# EAGLE design rekick002 (EAGLE 4.16)

## Sheet 1 of 2
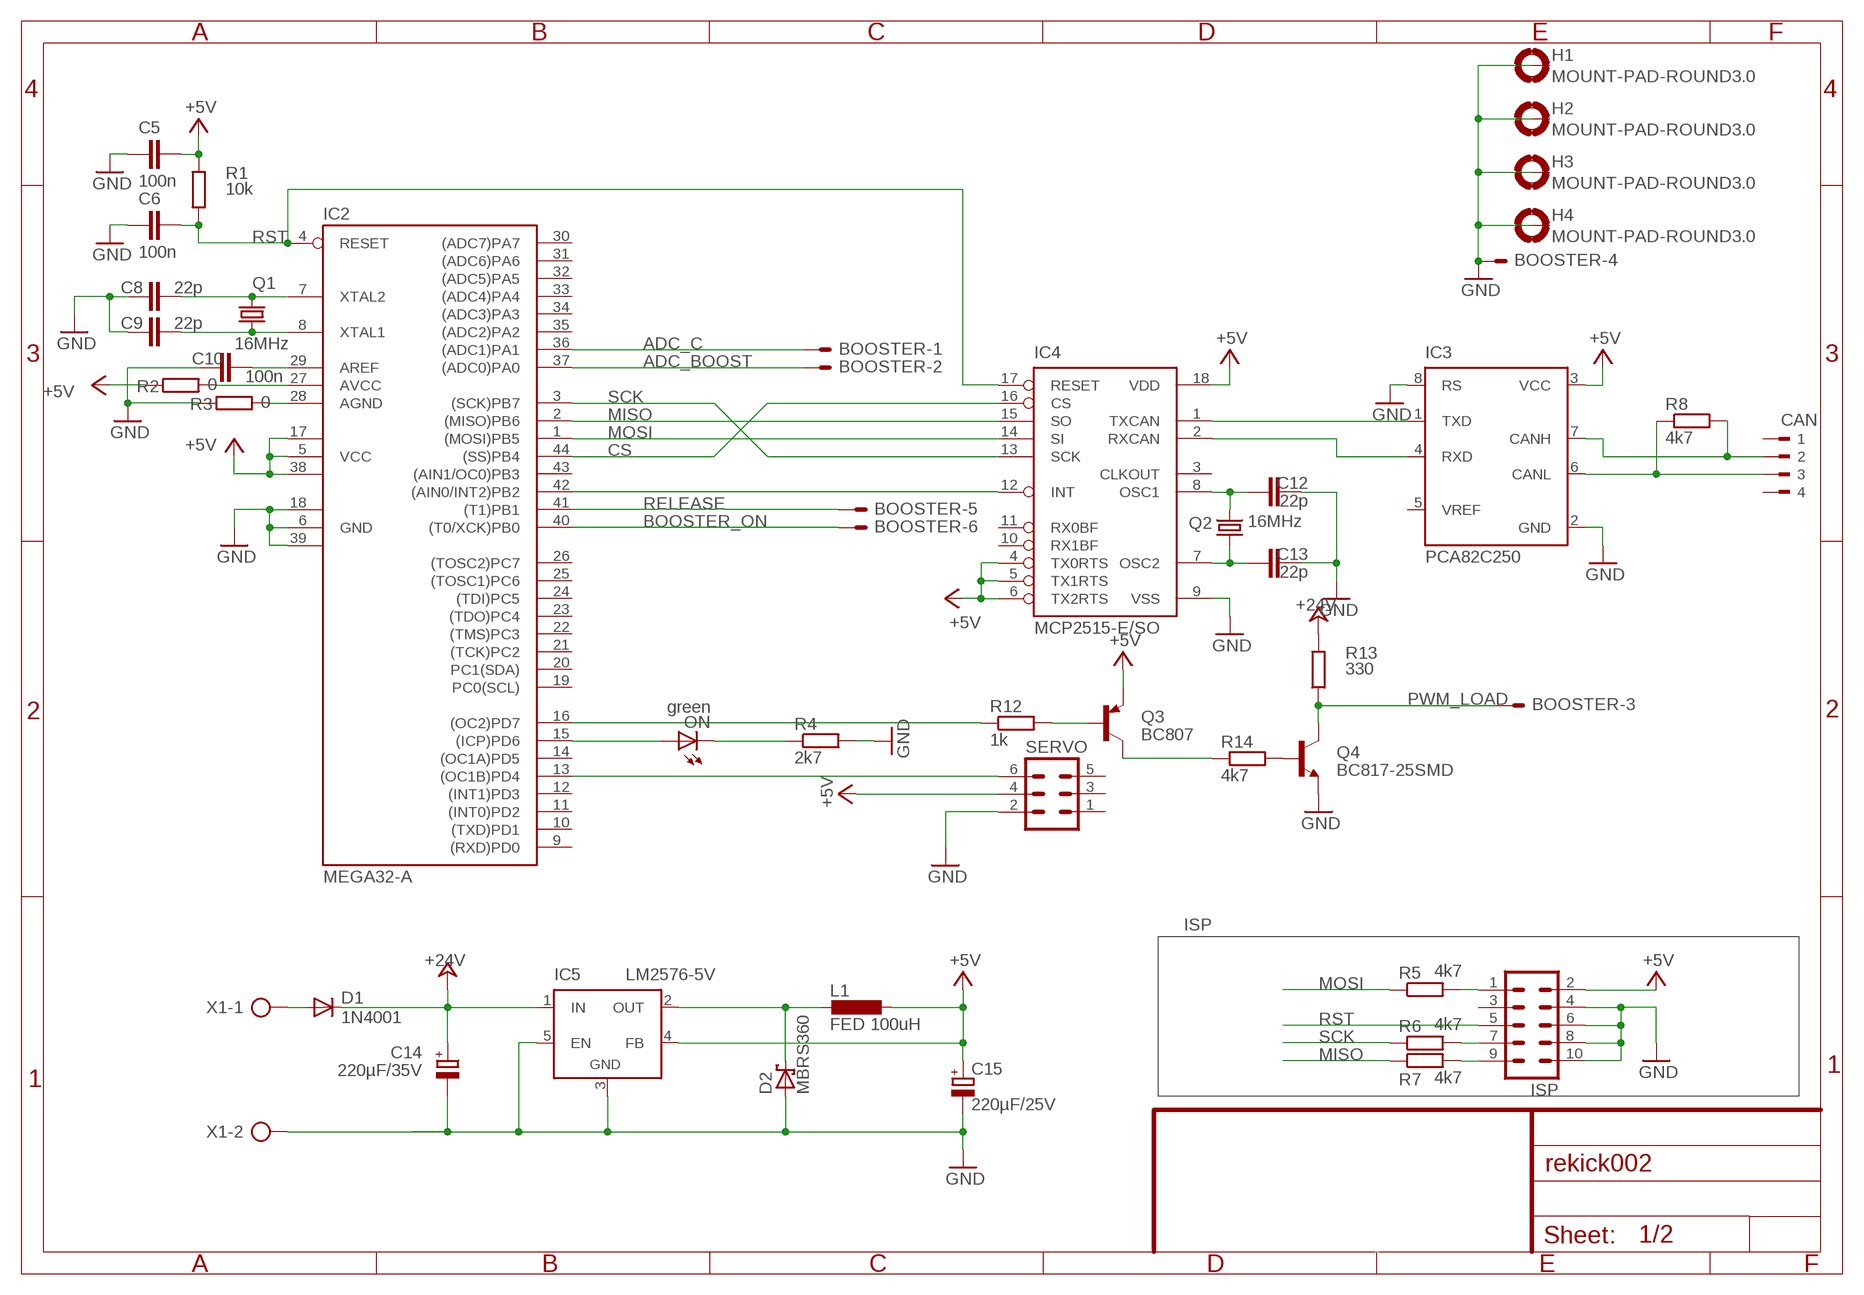
[diagram p0: schematic, sheet 1]

### Parts
BOOSTER  ML6LE  [ML6L]
C5  100n  C-EUC0603  [C0603]
C6  100n  C-EUC0603  [C0603]
C8  22p  C-EUC0603  [C0603]
C9  22p  C-EUC0603  [C0603]
C10  100n  C-EUC0603  [C0603]
C12  22p  C-EUC0603  [C0603]
C13  22p  C-EUC0603  [C0603]
C14  220µF/35V  CPOL-EUE5-10.5  [E5-10,5]
C15  220µF/25V  CPOL-EUE3.5-10  [E3,5-10]
CAN  90-4  [90-4]
D1  1N4001  1N4004  [DO41-10]
D2  MBRS360  SCHOTTKY-DIODESMD  [SMB]
H1  MOUNT-PAD-ROUND3.0  [3,0-PAD]
H2  MOUNT-PAD-ROUND3.0  [3,0-PAD]
H3  MOUNT-PAD-ROUND3.0  [3,0-PAD]
H4  MOUNT-PAD-ROUND3.0  [3,0-PAD]
IC2  MEGA32-A  [TQFP44]
IC3  PCA82C250  [DIL08]
IC4  MCP2515-E/SO  [SO18L]
IC5  LM2576-5V  LM2596TV  [TO220-51]
ISP  MA05-2  [MA05-2]
L1  FED 100uH  L-EUTJ4-U1  [TJ4-U1]
ON  green  LED3MM  [LED3MM]
Q1  16MHz  CRYSTALHC49S  [HC49/S]
Q2  16MHz  CRYSTALHC49U-V  [HC49U-V]
Q3  BC807  BC807-40SMD  [SOT23-BEC]
Q4  BC817-25SMD  [SOT23-BEC]
R1  10k  R-EU_R0805  [R0805]
R2  0  R-EU_R0805  [R0805]
R3  0  R-EU_R0805  [R0805]
R4  2k7  R-EU_R0805  [R0805]
R5  4k7  R-EU_R0805  [R0805]
R6  4k7  R-EU_R0805  [R0805]
R7  4k7  R-EU_R0805  [R0805]
R8  4k7  R-EU_R0805  [R0805]
R12  1k  R-EU_R0805  [R0805]
R13  330  R-EU_R0805  [R0805]
R14  4k7  R-EU_R0805  [R0805]
SERVO  ML6L  [ML6L]
X1  AK500/2-H  [AK500/2-H]

### Nets
+5V [Power]: C5.2 C15.+ IC2.5(VCC) IC2.17(VCC1) IC2.38(VCC2) IC3.3(VCC) IC4.4(TX0RTS) IC4.5(TX1RTS) IC4.6(TX2RTS) IC4.18(VDD) IC5.4(FB) ISP.2 L1.1 Q3.E R1.2 R2.1 SERVO.4
+24V [Power]: C14.+ D1.C IC5.1(IN) R13.2
ADC_BOOST: BOOSTER.2 IC2.37((ADC0)PA0)
ADC_C: BOOSTER.1 IC2.36((ADC1)PA1)
BOOSTER_ON: BOOSTER.6 IC2.40((T0/XCK)PB0)
CS: IC2.44((SS)PB4) IC4.16(CS)
GND [Power]: BOOSTER.4 C5.1 C6.1 C8.1 C9.2 C10.1 C12.2 C13.2 C14.- C15.- D2.A H1.B3,0(MOUNT) H2.B3,0(MOUNT) H3.B3,0(MOUNT) H4.B3,0(MOUNT) IC2.6(GND) IC2.18(GND1) IC2.39(GND2) IC3.2(GND) IC3.8(RS) IC4.9(VSS) IC5.3(GND) IC5.5(EN) ISP.4 ISP.6 ISP.8 ISP.10 Q4.E R3.1 R4.2 SERVO.2 X1.2
MISO: IC2.2((MISO)PB6) IC4.15(SO) R7.1
MOSI: IC2.1((MOSI)PB5) IC4.14(SI) R5.1
N$1: IC2.15((ICP)PD6) ON.A
N$2: C10.2 IC2.29(AREF)
N$3: IC2.27(AVCC) R2.2
N$4: C9.1 IC2.8(XTAL1) Q1.1
N$5: C8.2 IC2.7(XTAL2) Q1.2
N$6: ISP.1 R5.2
N$7: IC2.28(AGND) R3.2
N$8: ISP.7 R6.2
N$9: ISP.9 R7.2
N$11: IC2.42((AIN0/INT2)PB2) IC4.12(INT)
N$12: IC3.1(TXD) IC4.1(TXCAN)
N$13: IC2.16((OC2)PD7) R12.1
N$14: IC2.13((OC1B)PD4) SERVO.6
N$21: Q3.C R14.1
N$22: IC3.4(RXD) IC4.2(RXCAN)
N$23: Q4.B R14.2
N$24: CAN.3 IC3.6(CANL) R8.1
N$25: Q3.B R12.2
N$26: D1.A X1.1
N$30 [Power]: D2.C IC5.2(OUT) L1.2
N$31: ON.K(C) R4.1
N$53: C13.1 IC4.7(OSC2) Q2.1
N$54: C12.1 IC4.8(OSC1) Q2.2
N$59: CAN.2 IC3.7(CANH) R8.2
PWM_LOAD: BOOSTER.3 Q4.C R13.1
RELEASE: BOOSTER.5 IC2.41((T1)PB1)
RST: C6.2 IC2.4(RESET) IC4.17(RESET) ISP.5 R1.1
SCK: IC2.3((SCK)PB7) IC4.13(SCK) R6.1
Unconnected: CAN.1 CAN.4 IC2.9((RXD)PD0) IC2.10((TXD)PD1) IC2.11((INT0)PD2) IC2.12((INT1)PD3) IC2.14((OC1A)PD5) IC2.19(PC0(SCL)) IC2.20(PC1(SDA)) IC2.21((TCK)PC2) IC2.22((TMS)PC3) IC2.23((TDO)PC4) IC2.24((TDI)PC5) IC2.25((TOSC1)PC6) IC2.26((TOSC2)PC7) IC2.30((ADC7)PA7) IC2.31((ADC6)PA6) IC2.32((ADC5)PA5) IC2.33((ADC4)PA4) IC2.34((ADC3)PA3) IC2.35((ADC2)PA2) IC2.43((AIN1/OC0)PB3) IC3.5(VREF) IC4.3(CLKOUT) IC4.10(RX1BF) IC4.11(RX0BF) ISP.3 SERVO.1 SERVO.3 SERVO.5

### Notes on the sheet
- ISP

## Sheet 2 of 2
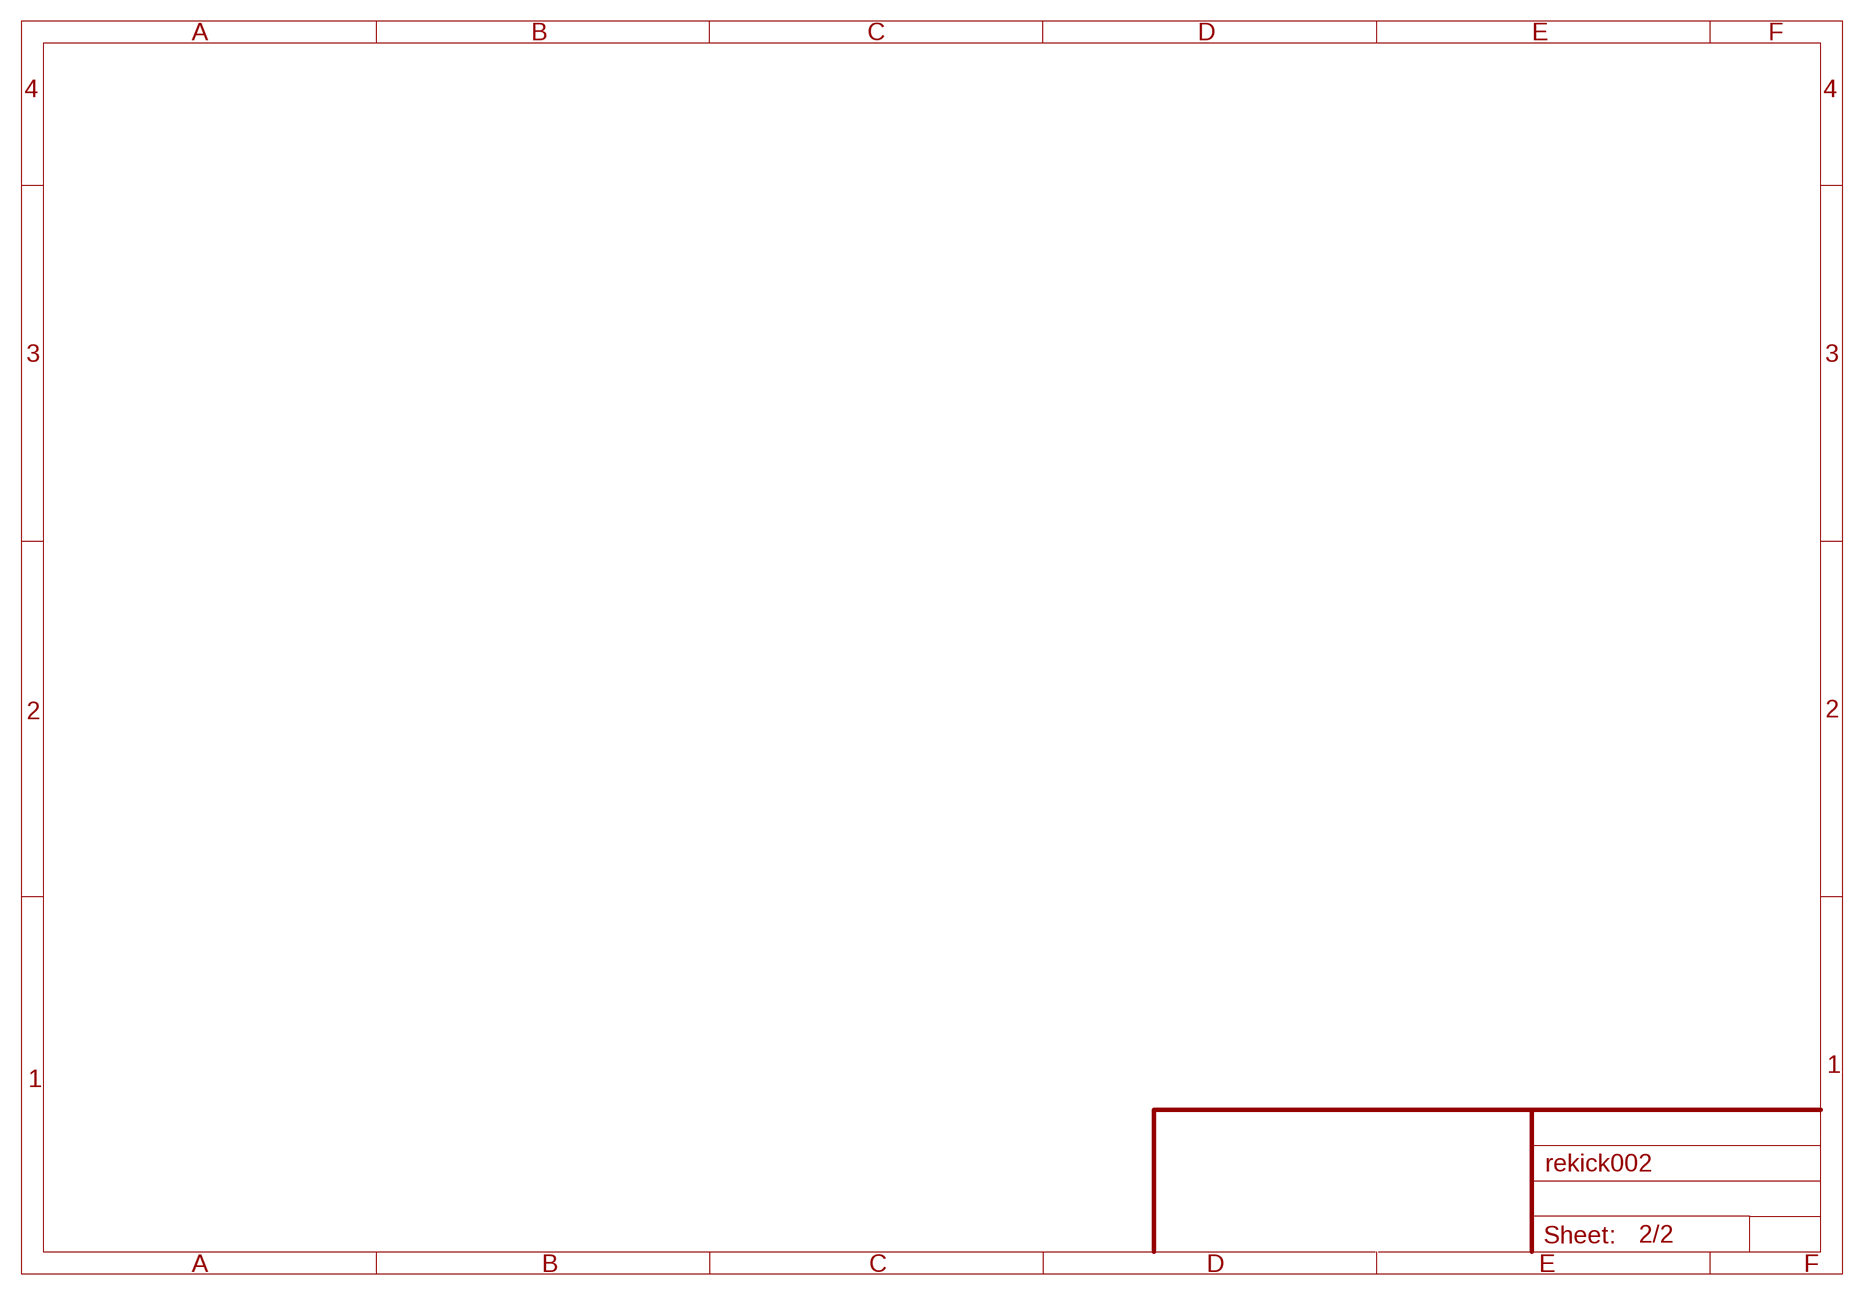
[diagram p1: schematic, sheet 2]

## Library data of the parts
BOOSTER = con-harting-ml:ML6?E: HARTING
C5 C6 C8-C10 C12 C13 = rcl:C-EU: CAPACITOR, European symbol
C14 C15 = rcl:CPOL-EU: POLARIZED CAPACITOR, European symbol
CAN = con-weidmueller-sl35:90-4: WEIDMUELLER CLAMP CONNECTOR
D1 = diode:1N4004: DIODE general purpose rectifier, 1 A
D2 = diode:SCHOTTKY-DIODE: Schottky Diode
H1-H4 = holes:MOUNT-PAD-ROUND: MOUNTING PAD, round
IC2 = atmel:MEGA32: MICROCONTROLLER 32 Kbytes FLASH 2 Kbytes SRAM 1 Kbytes EEPROM USART 8-channel 10 bit ADC Source: www.atmel.com .. doc2503.pdf
IC3 = micro-philips:PCA82C250: CAN CONTROLLER INTERFACE
IC4 = mcp2515:MCP2515
IC5 = linear:LM2596T: STEP-DOWN VOLTAGE REGULATOR
ISP = con-lstb:MA05-2: PIN HEADER
L1 = rcl:L-EU: INDUCTOR, European symbol
ON = led:LED: LED OSRAM: - CHIPLED LG R971, LG N971, LY N971, LG Q971, LY Q971, LO R971, LY R971 LH N974, LH R974 LS Q976, LO Q976, LY Q976 LO Q996 - Hyper CHIPLED LW Q18S LB Q993, LB Q99A, LB R99A - SideLED LS A670, LO A670, LY A670, LG A670, LP A670 LB A673, LV A673, LT A673, LW A673 LH A674 LY A675 LS A676, LA A676, LO A676, LY A676, LW A676 LS A679, LY A679, LG A679 - Hyper Micro SIDELED® LS Y876, LA Y876, LO Y876, LY Y876 LT Y87S - SmartLED LW L88C, LW L88S LB L89C, LB L89S, LG L890 LS L89K, LO L89K, LY L89K LS L896, LA L896, LO L896, LY L896 - TOPLED LS T670, LO T670, LY T670, LG T670, LP T670 LSG T670, LSP T670, LSY T670, LOP T670, LYG T670 LG T671, LOG T671, LSG T671 LB T673, LV T673, LT T673, LW T673 LH T674 LS T676, LA T676, LO T676, LY T676, LB T676, LH T676, LSB T676, LW T676 LB T67C, LV T67C, LT T67C, LS T67K, LO T67K, LY T67K, LW E67C LS E67B, LA E67B, LO E67B, LY E67B, LB E67C, LV E67C, LT E67C LW T67C LS T679, LY T679, LG T679 LS T770, LO T770, LY T770, LG T770, LP T770 LB T773, LV T773, LT T773, LW T773 LH T774 LS E675, LA E675, LY E675, LS T675 LS T776, LA T776, LO T776, LY T776, LB T776 LHGB T686 LT T68C, LB T68C - Hyper Mini TOPLED® LB M676 - Mini TOPLED Santana® LG M470 LS M47K, LO M47K, LY M47K Source: http://www.osram.convergy.de - LUMILED® LXK2-PW12-R00, LXK2-PW12-S00, LXK2-PW14-U00, LXK2-PW14-V00 LXK2-PM12-R00, LXK2-PM12-S00, LXK2-PM14-U00 LXK2-PE12-Q00, LXK2-PE12-R00, LXK2-PE12-S00, LXK2-PE14-T00, LXK2-PE14-U00 LXK2-PB12-K00, LXK2-PB12-L00, LXK2-PB12-M00, LXK2-PB14-N00, LXK2-PB14-P00, LXK2-PB14-Q00 LXK2-PR12-L00, LXK2-PR12-M00, LXK2-PR14-Q00, LXK2-PR14-R00 LXK2-PD12-Q00, LXK2-PD12-R00, LXK2-PD12-S00 LXK2-PH12-R00, LXK2-PH12-S00 LXK2-PL12-P00, LXK2-PL12-Q00, LXK2-PL12-R00 Source: www.luxeon.com
Q1 Q2 = crystal:CRYSTAL: CRYSTAL
Q3 = transistor-pnp:BC807*: PNP Transistror
Q4 = transistor-npn:BC817*: NPN Transistor
R1-R8 R12-R14 = rcl:R-EU_: RESISTOR, European symbol
SERVO = con-harting-ml:ML6: HARTING
X1 = con-ptr500:AK500/2-H: CONNECTOR Aug. 2004 / PTR Meßtechnik: Die Bezeichnung der Serie AK505 wurde geändert. Es handelt sich hierbei um AK500 in horizontaler Ausführung.

## Net classes
1 Power: width 0.406 mm
2 High Power: width 2 mm

## Board
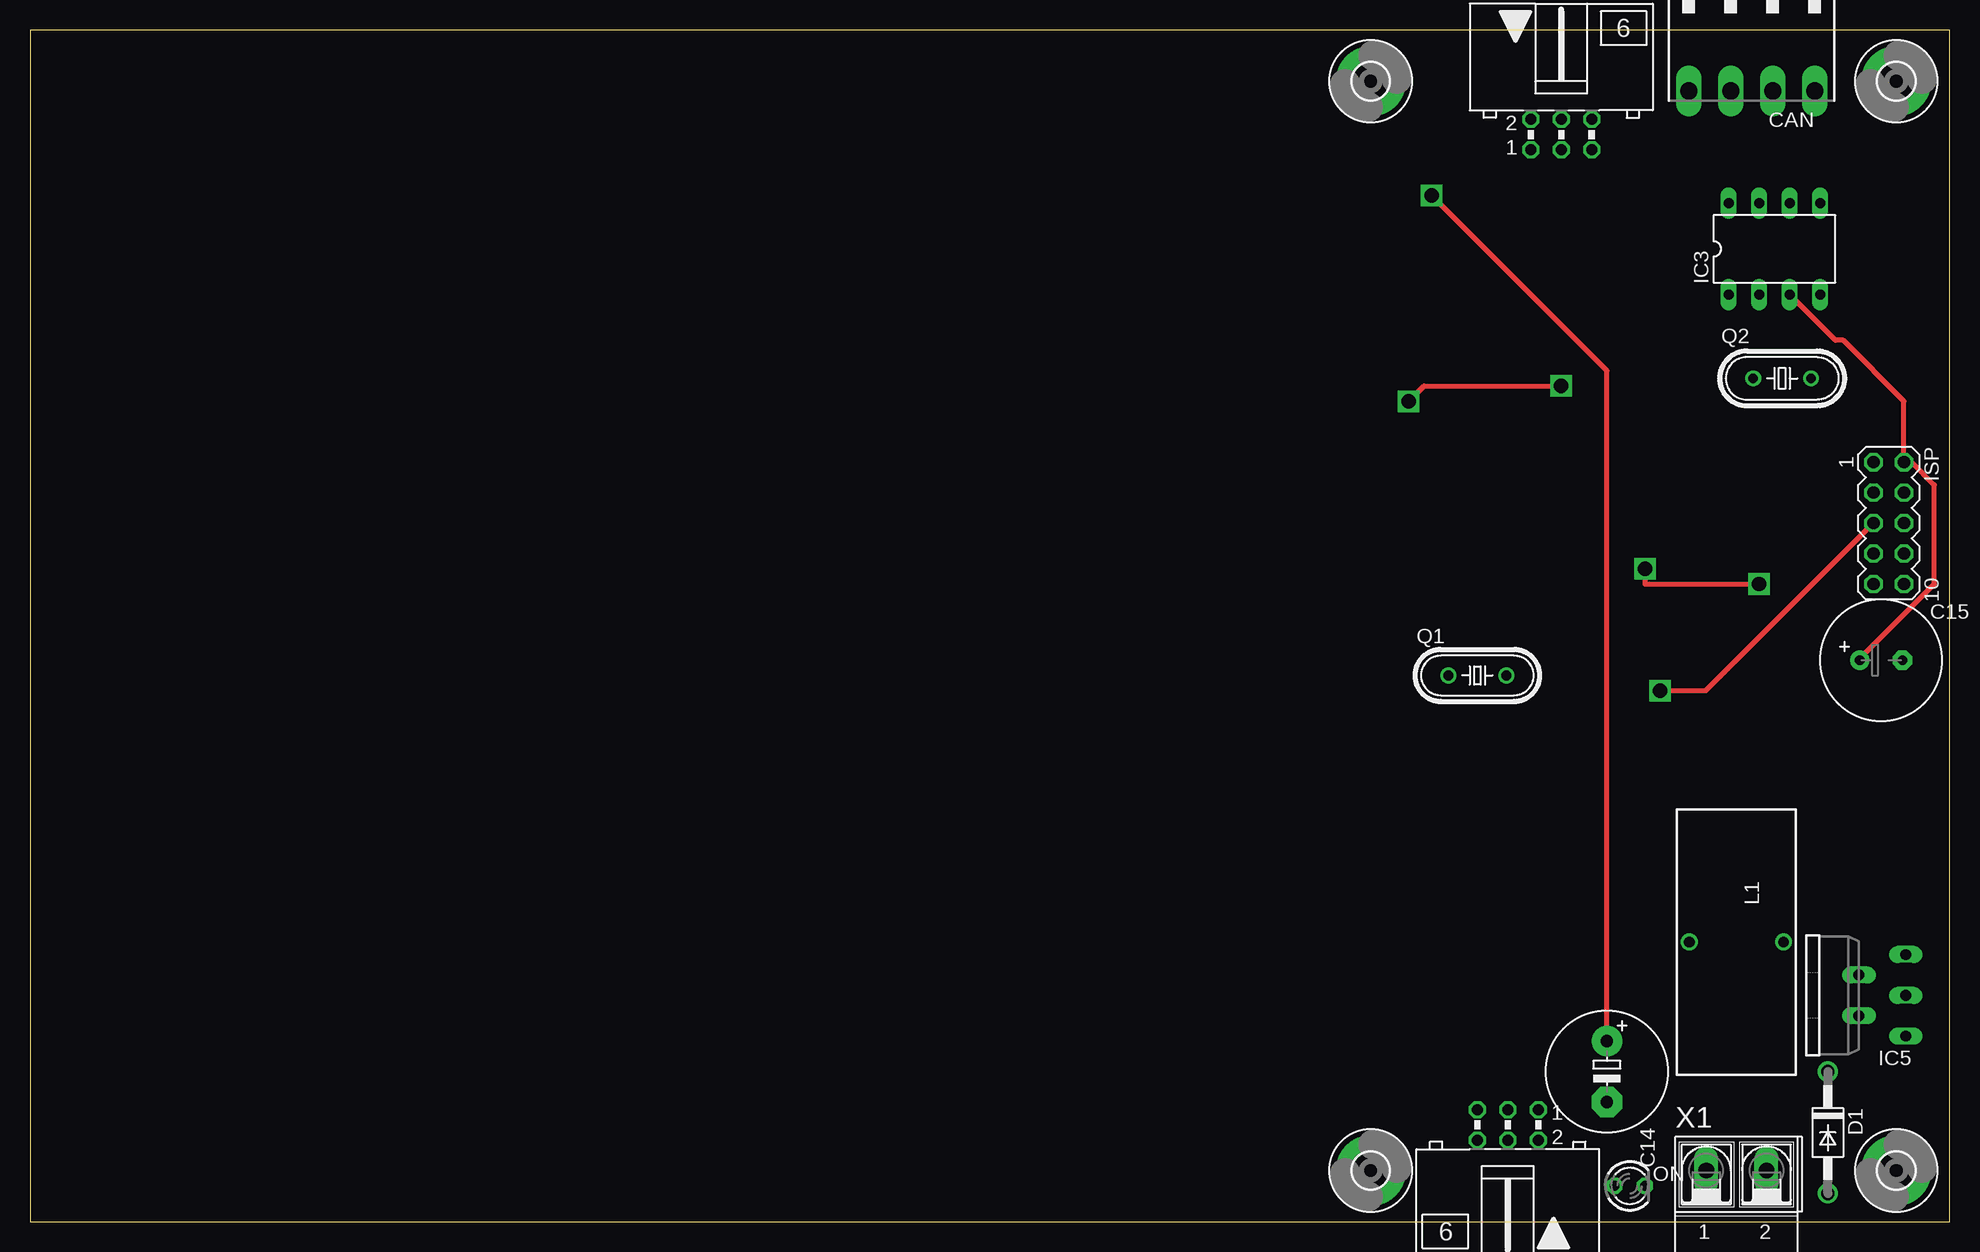
[diagram p2: board, top side]
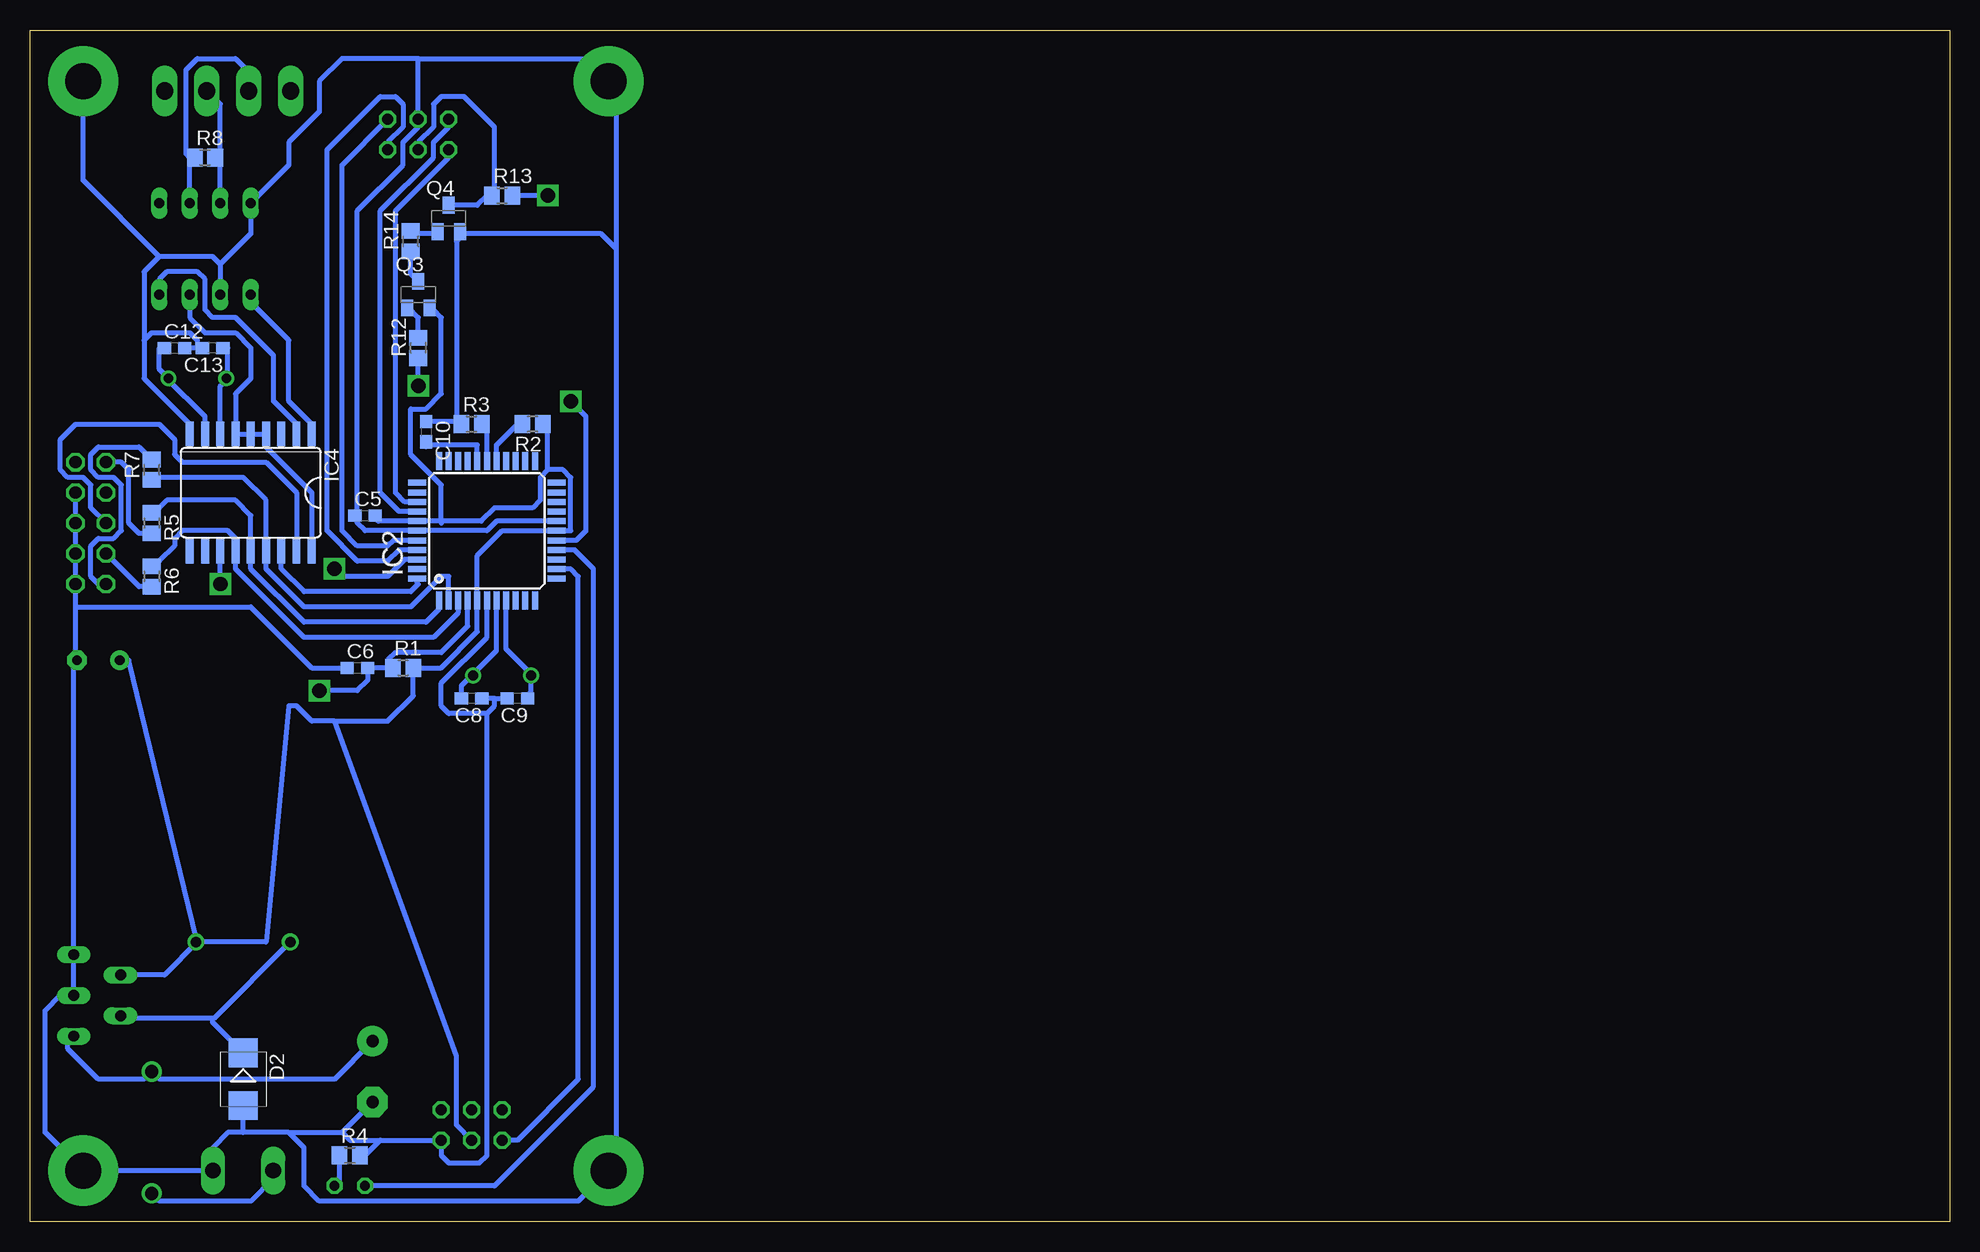
[diagram p3: board, bottom side, seen from below]

Size 160 x 99.36 mm. Coordinates in mm from the lower left corner, seen from the top.
Outline: 0,0 160,0 160,99.36 0,99.36 0,0
Copper layers (1*16): Top 0.035mm / dielectric 1.5mm / Bottom 0.035mm
Design rules "olimex_8mils": minimum track width 10mil, minimum drill 24mil, track to track 8mil, track to pad 8mil, pad to pad 8mil, via to via 8mil, smd to smd 8mil, copper to edge 40mil, drill to drill 10mil, minimum pad ring 10mil, minimum via ring 8mil, stop-mask expansion 0mil, vias tented up to drill 0mil, thermal gap 10mil

### Footprints (pad centres in the part's own frame; a part is rotated, then mirrored left to right if it is on the bottom)
ML6L = drill 0.914 octagon: 1 -2.54,-1.27; 2 -2.54,1.27; 3 0,-1.27; 4 0,1.27; 5 2.54,-1.27; 6 2.54,1.27
C0603 = smd 1.1 x 1: 1 -0.85,0; 2 0.85,0
E5-10,5 = drill 1.016 pad 2.54 round: + -2.54,0 | drill 1.016 pad 2.54 octagon: - 2.54,0
E3,5-10 = drill 0.813 pad 1.6 round: + -1.778,0 | drill 0.813 pad 1.6 octagon: - 1.778,0
90-4 = drill 1.422 long: 1 -5.25,5.25; 2 -1.75,5.25; 3 1.75,5.25; 4 5.25,5.25
DO41-10 = drill 1.118 round: A 5.08,0; C -5.08,0
SMB = smd 2.4 x 2.4: A 2.2,0; C -2.2,0
3,0-PAD = drill 3 pad 5.842 round: B3,0 0,0
TQFP44 = smd 1.5 x 0.5: 1 -5.8,4; 2 -5.8,3.2; 3 -5.8,2.4; 4 -5.8,1.6; 5 -5.8,0.8; 6 -5.8,0; 7 -5.8,-0.8; 8 -5.8,-1.6; 9 -5.8,-2.4; 10 -5.8,-3.2; 11 -5.8,-4; 23 5.8,-4; 24 5.8,-3.2; 25 5.8,-2.4; 26 5.8,-1.6; 27 5.8,-0.8; 28 5.8,0; 29 5.8,0.8; 30 5.8,1.6; 31 5.8,2.4; 32 5.8,3.2; 33 5.8,4 | smd 0.5 x 1.5: 12 -4,-5.8; 13 -3.2,-5.8; 14 -2.4,-5.8; 15 -1.6,-5.8; 16 -0.8,-5.8; 17 0,-5.8; 18 0.8,-5.8; 19 1.6,-5.8; 20 2.4,-5.8; 21 3.2,-5.8; 22 4,-5.8; 34 4,5.8; 35 3.2,5.8; 36 2.4,5.8; 37 1.6,5.8; 38 0.8,5.8; 39 0,5.8; 40 -0.8,5.8; 41 -1.6,5.8; 42 -2.4,5.8; 43 -3.2,5.8; 44 -4,5.8
DIL08 = drill 0.813 long: 1 -3.81,-3.81; 2 -1.27,-3.81; 3 1.27,-3.81; 4 3.81,-3.81; 5 3.81,3.81; 6 1.27,3.81; 7 -1.27,3.81; 8 -3.81,3.81
SO18L = smd 0.66 x 2.032: 1 -5.08,-4.902; 2 -3.81,-4.902; 3 -2.54,-4.902; 4 -1.27,-4.902; 5 0,-4.902; 6 1.27,-4.902; 7 2.54,-4.902; 8 3.81,-4.902; 9 5.08,-4.902; 10 5.08,4.902; 11 3.81,4.902; 12 2.54,4.902; 13 1.27,4.902; 14 0,4.902; 15 -1.27,4.902; 16 -2.54,4.902; 17 -3.81,4.902; 18 -5.08,4.902
TO220-51 = drill 0.9 long: 1 -3.4,-8.4; 2 -1.7,-4.5; 3 0,-8.4; 4 1.7,-4.5; 5 3.4,-8.4
MA05-2 = drill 1.016 octagon: 1 -5.08,-1.27; 2 -5.08,1.27; 3 -2.54,-1.27; 4 -2.54,1.27; 5 0,-1.27; 6 0,1.27; 7 2.54,-1.27; 8 2.54,1.27; 9 5.08,-1.27; 10 5.08,1.27
TJ4-U1 = drill 0.9 round: 1 -3.935,0; 2 3.935,0
LED3MM = drill 0.813 octagon: A -1.27,0; K 1.27,0
HC49/S = drill 0.813 round: 1 -2.413,0; 2 2.413,0
HC49U-V = drill 0.813 round: 1 -2.413,0; 2 2.413,0
SOT23-BEC = smd 1 x 1.4: B -0.95,-1.1; C 0,1.1; E 0.95,-1.1
R0805 = smd 1.3 x 1.5: 1 -0.85,0; 2 0.85,0
AK500/2-H = drill 1.321 long: 1 -2.515,0; 2 2.515,0

### Placement (x,y rotation side)
BOOSTER  127.63,90.64 0 top
C5  132.07,58.89 0 bottom
C6  132.71,46.19 0 bottom
C8  123.19,43.65 180 bottom
C9  119.38,43.65 180 bottom
C10  126.99,65.88 270 bottom
C12  147.95,72.86 0 bottom
C13  144.78,72.86 180 bottom
C14  131.44,12.54 270 top
C15  154.3,46.83 0 top
CAN  143.5,99.53 180 top
D1  149.85,7.46 270 top
D2  142.23,11.9 270 bottom
H1  111.75,95.08 0 top
H2  111.75,4.28 0 top
H3  155.57,95.08 0 top
H4  155.57,4.28 0 top
IC2  121.91,57.62 90 bottom
IC3  145.41,81.11 0 top
IC4  141.6,60.8 180 bottom
IC5  147.95,18.89 90 top
ISP  154.94,58.26 270 top
L1  142.23,23.33 180 top
ON  133.34,3.01 0 top
Q1  120.64,45.55 0 top
Q2  146.04,70.32 0 top
Q3  127.63,77.3 0 bottom
Q4  125.09,83.65 0 bottom
R1  128.9,46.19 0 bottom
R2  118.1,66.51 180 bottom
R3  123.19,66.51 0 bottom
R4  133.34,5.55 0 bottom
R5  149.85,58.26 270 bottom
R6  149.85,53.81 270 bottom
R7  149.85,62.7 90 bottom
R8  145.41,88.73 0 bottom
R12  127.63,72.86 90 bottom
R13  120.64,85.56 0 bottom
R14  128.27,81.75 90 bottom
SERVO  123.19,8.09 180 top
X1  142.23,4.28 0 top

### Tracks (layer width: path | path; a pad name or v marks a point on that pad's centre or on a via)
+5V
  Top 0.406: IC3.3 150.49,73.49 151.12,73.49 156.2,68.41 ISP.2 156.84,63.34 158.75,61.43 158.75,53.18 152.39,46.83 C15.+
  Bottom 0.406: 116.2,57.62 120.64,57.62 122.71,55.55 IC2.5 122.71,49.2 125.72,46.19 R1.2 128.05,43.87 130.17,41.74 132.71,41.74 | 125.72,58.42 122.38,58.42 121.28,59.52 118.1,59.52 117.47,60.16 117.47,62.06 116.83,62.7 | 125.72,58.42 IC2.38 130.97,58.42 131.44,58.89 C5.2 | 116.83,62.7 115.56,62.7 114.93,62.06 114.93,57.62 116.2,57.62 | 116.2,57.62 IC2.17 | R2.1 116.83,66.09 116.83,62.7 | IC3.3 146.68,75.4 145.41,74.13 142.87,74.13 141.6,72.86 141.6,70.32 142.87,69.05 IC4.6 141.78,65.7 141.6,65.88 IC4.5 140.51,65.7 140.33,65.88 IC4.4 140.33,64.6 136.52,60.8 IC4.18 | IC5.4 148.79,20.59 146.04,23.33 | C15.+ 151.76,46.83 146.04,23.33 | SERVO.4 124.45,8.09 124.45,13.81 134.62,41.74 | 146.04,23.33 L1.1 | 146.04,23.33 140.33,23.33 138.42,43.02 137.79,43.02 136.52,41.74 134.62,41.74 | 134.62,41.74 132.71,41.74 | 132.71,41.74 132.5,41.74 | 125.72,58.42 125.72,58.26 | 125.72,58.42 125.72,61.43 128.27,63.97 128.27,67.78 126.99,67.78 125.72,69.05 125.72,75.4 126.36,76.03 | 126.36,76.03 126.51,76.03 | 126.36,76.03 126.53,76.2 Q3.E
+24V  (via drill 1.2)
  Top 0.406: C14.+ 131.44,70.95 v116.83,85.56
  Bottom 0.406: IC5.1 156.98,15.57 156.84,15.71 156.84,14.44 154.3,11.9 150.49,11.9 D1.C 149.22,11.9 134.62,11.9 C14.+ | 120.01,85.56 R13.2 v116.83,85.56
ADC_BOOST
  Bottom 0.406: IC2.37 129.23,59.22 130.81,60.8 130.81,84.29 126.36,88.73 126.36,90 125.09,91.27 BOOSTER.2
ADC_C
  Bottom 0.406: IC2.36 128.76,60.02 129.53,60.8 129.53,84.29 125.09,88.73 BOOSTER.1
BOOSTER_ON
  Bottom 0.406: IC2.40 129.7,56.82 130.17,56.35 132.71,56.35 133.98,57.62 133.98,88.1 BOOSTER.6
CS
  Bottom 0.406: IC4.16 139.06,54.45 137.16,52.54 128.27,52.54 127.63,53.18 127.71,53.26 IC2.44
GND
  Bottom 0.406: IC2.18 121.11,58.42 121.91,57.62 IC2.39 132.07,57.62 132.71,58.26 132.71,58.89 C5.1 132.71,59.11 132.71,84.29 128.9,88.1 128.9,90 127.63,91.27 BOOSTER.4 127.63,96.99 | 120.01,43.65 C9.2 121.28,43.65 | 121.28,43.65 C8.1 | IC2.6 121.91,48.73 125.72,44.92 125.72,43.02 125.09,42.38 121.91,42.38 | 121.28,43.65 121.28,43.02 121.91,42.38 | ISP.4 ISP.6 ISP.8 ISP.10 156.2,51.27 | 146.04,72.86 C12.2 | IC4.9 146.68,66.51 150.49,70.32 150.49,73.49 | 150.49,73.49 149.85,74.13 146.68,74.13 146.04,73.49 146.04,72.86 | 146.04,72.86 C13.2 | 144.14,79.84 IC3.2 | 144.14,79.84 144.78,80.48 149.22,80.48 | 149.22,80.48 150.49,79.21 150.49,73.49 | 144.14,79.84 141.6,82.38 IC3.8 138.42,88.1 138.42,90 135.88,92.54 135.88,95.08 133.98,96.99 127.63,96.99 | H3.B3,0 155.57,86.83 149.22,80.48 | X1.2 H4.B3,0 158.75,7.46 158.75,17.62 157.47,18.89 IC5.3 156.35,21.91 156.2,22.06 156.35,22.21 IC5.5 156.35,46.68 156.2,46.83 | X1.2 144.75,3.62 | 123.82,82.38 112.39,82.38 111.12,81.11 | 123.82,82.38 123.97,82.38 Q4.E 123.99,82.55 123.82,82.38 | 130.81,6.82 SERVO.2 125.72,5.55 125.09,4.92 122.55,4.92 121.91,5.55 121.91,42.38 | 130.81,6.82 132.07,5.55 R4.2 132.5,5.13 | X1.2 144.75,6.21 143.5,7.46 142.23,7.46 | 138.42,7.46 142.23,7.46 | 138.42,7.46 137.16,6.18 137.16,3.01 135.88,1.74 114.3,1.74 H2.B3,0 111.12,4.92 111.12,81.11 | 156.2,46.83 C15.- | 156.2,46.83 156.2,51.27 | 142.23,7.46 D2.A | 133.98,7.46 C14.- | 138.42,7.46 133.98,7.46 | 133.98,7.46 133.34,6.82 130.81,6.82 | C6.1 136.52,46.19 141.6,51.27 156.2,51.27 | C10.1 124.03,66.72 123.82,66.51 R3.1 124.45,66.51 124.45,81.75 123.82,82.38 | 127.63,96.99 113.66,96.99 H1.B3,0 111.12,94.45 111.12,81.11
MISO
  Bottom 0.406: IC2.2 125.09,51.84 125.09,53.81 125.72,53.81 128.27,51.27 137.16,51.27 140.33,54.45 IC4.15 140.33,60.16 142.23,62.06 149.22,62.06 149.85,61.43 R7.1
MOSI
  Bottom 0.406: IC2.1 125.91,51.08 126.99,50 137.16,50 141.6,54.45 IC4.14 141.6,58.89 142.87,60.16 148.59,60.16 149.85,58.89 R5.1
N$1
  Bottom 0.406: IC2.15 114.6,56.02 113.02,54.45 113.02,11.27 121.28,3.01 ON.A
N$2
  Bottom 0.406: IC2.29 122.71,64.77 126.83,64.77 126.99,64.6 C10.2
N$3
  Bottom 0.406: R2.2 119.38,66.51 121.11,64.77 IC2.27
N$4
  Bottom 0.406: C9.1 118.74,43.65 118.23,44.16 Q1.1 118.1,45.55 120.31,47.77 IC2.8
N$5
  Bottom 0.406: IC2.7 121.11,47.62 123.19,45.55 | 123.19,45.55 Q1.2 | C8.2 124.03,44.7 123.19,45.55
N$6
  Bottom 0.406: R5.2 150.91,57.41 151.76,58.26 151.76,62.7 152.39,63.34 ISP.1
N$7
  Bottom 0.406: R3.2 121.91,66.51 IC2.28
N$8
  Bottom 0.406: R6.2 150.91,52.96 ISP.7
N$9
  Bottom 0.406: ISP.9 154.3,53.18 154.94,53.81 154.94,56.35 154.3,56.98 153.03,56.98 152.39,57.62 152.39,61.43 153.03,62.06 154.3,62.06 154.94,62.7 154.94,63.97 154.3,64.6 150.91,64.6 R7.2
N$11  (via drill 1.2)
  Top 0.406: v134.62,54.45 134.62,53.18 v144.14,53.18
  Bottom 0.406: IC2.42 128.76,55.22 130.17,53.81 133.98,53.81 v134.62,54.45 | v144.14,53.18 IC4.12
N$12
  Bottom 0.406: IC3.1 141.6,76.67 138.42,73.49 138.42,68.41 136.52,66.51 IC4.1
N$13  (via drill 1.2)
  Top 0.406: v127.63,69.68 116.2,69.68 v114.93,68.41
  Bottom 0.406: IC2.16 114.46,56.82 113.66,57.62 113.66,67.14 v114.93,68.41 | v127.63,69.68 R12.1
N$14
  Bottom 0.406: IC2.13 114.91,54.42 114.3,53.81 114.3,11.9 119.38,6.82 SERVO.6
N$21
  Bottom 0.406: Q3.C 128.27,79.04 R14.1
N$22
  Bottom 0.406: IC3.4 149.22,78.57 148.59,79.21 146.04,79.21 145.41,78.57 145.41,76.03 144.78,75.4 142.87,75.4 139.69,72.22 139.69,68.41 137.79,66.51 IC4.2
N$23
  Bottom 0.406: R14.2 128.27,82.38 126.21,82.38 Q4.B
N$24
  Bottom 0.406: CAN.3 141.75,94.29 141.6,94.45 141.6,95.72 142.87,96.99 146.04,96.99 147,96.04 147,89.05 146.68,88.73 | IC3.6 146.68,88.73 | 146.68,88.73 R8.1
N$25
  Bottom 0.406: Q3.B 128.44,76.2 127.63,75.4 R12.2
N$26
  Bottom 0.406: 139.72,4.3 X1.1 139.72,3.62 141.6,1.74 149.22,1.74 D1.A
N$30
  Bottom 0.406: IC5.2 152.39,17.13 152.39,16.98 144.78,16.98 | L1.2 144.65,16.98 144.78,16.98 | D2.C 144.78,16.64 144.78,16.98
N$31
  Bottom 0.406: R4.1 134.19,3.43 ON.K
N$53
  Bottom 0.406: IC4.7 144.14,69.68 143.5,70.32 Q2.1 143.5,70.45 143.5,72.86 C13.1
N$54
  Bottom 0.406: IC4.8 145.41,67.14 148.59,70.32 Q2.2 149.22,71.08 149.22,72.86 C12.1
N$59
  Bottom 0.406: 145.25,94.29 145.41,94.45 | 145.25,94.29 CAN.2 | 145.25,94.29 144.14,93.18 144.14,88.73 | IC3.7 144.14,88.73 | 144.14,88.73 R8.2
PWM_LOAD
  Bottom 0.406: BOOSTER.3 127.63,90 126.36,91.27 126.36,93.18 125.72,93.81 123.82,93.81 121.28,91.27 121.28,85.77 R13.1 121.91,85.56 122.72,84.75 Q4.C
RELEASE
  Bottom 0.406: IC2.41 129.23,56.02 130.17,55.08 132.71,55.08 135.25,57.62 135.25,89.37 130.81,93.81 129.53,93.81 128.9,93.18 128.9,91.27 130.17,90 BOOSTER.5
RST  (via drill 1.2)
  Top 0.406: v135.88,44.29 139.69,44.29 ISP.5
  Bottom 0.406: IC2.4 123.52,49.67 125.72,47.46 129.53,47.46 130.17,46.83 130.17,46.19 | 130.17,46.19 R1.1 | 137.79,55.72 IC4.17 137.79,60.8 140.33,63.34 147.31,63.34 147.95,63.97 147.95,65.24 149.22,66.51 156.2,66.51 157.47,65.24 157.47,62.7 156.84,62.06 155.57,62.06 154.94,61.43 154.94,59.52 ISP.5 | 130.17,46.19 C6.2 131.86,45.13 132.71,44.29 v135.88,44.29
SCK
  Bottom 0.406: IC2.3 124.31,50.77 126.36,48.73 137.16,48.73 142.87,54.45 IC4.13 142.87,56.98 143.5,57.62 147.31,57.62 147.95,56.98 147.95,56.35 149.22,55.08 149.85,55.08 R6.1